# EAGLE schematic ECG_Charge (EAGLE 6.4)
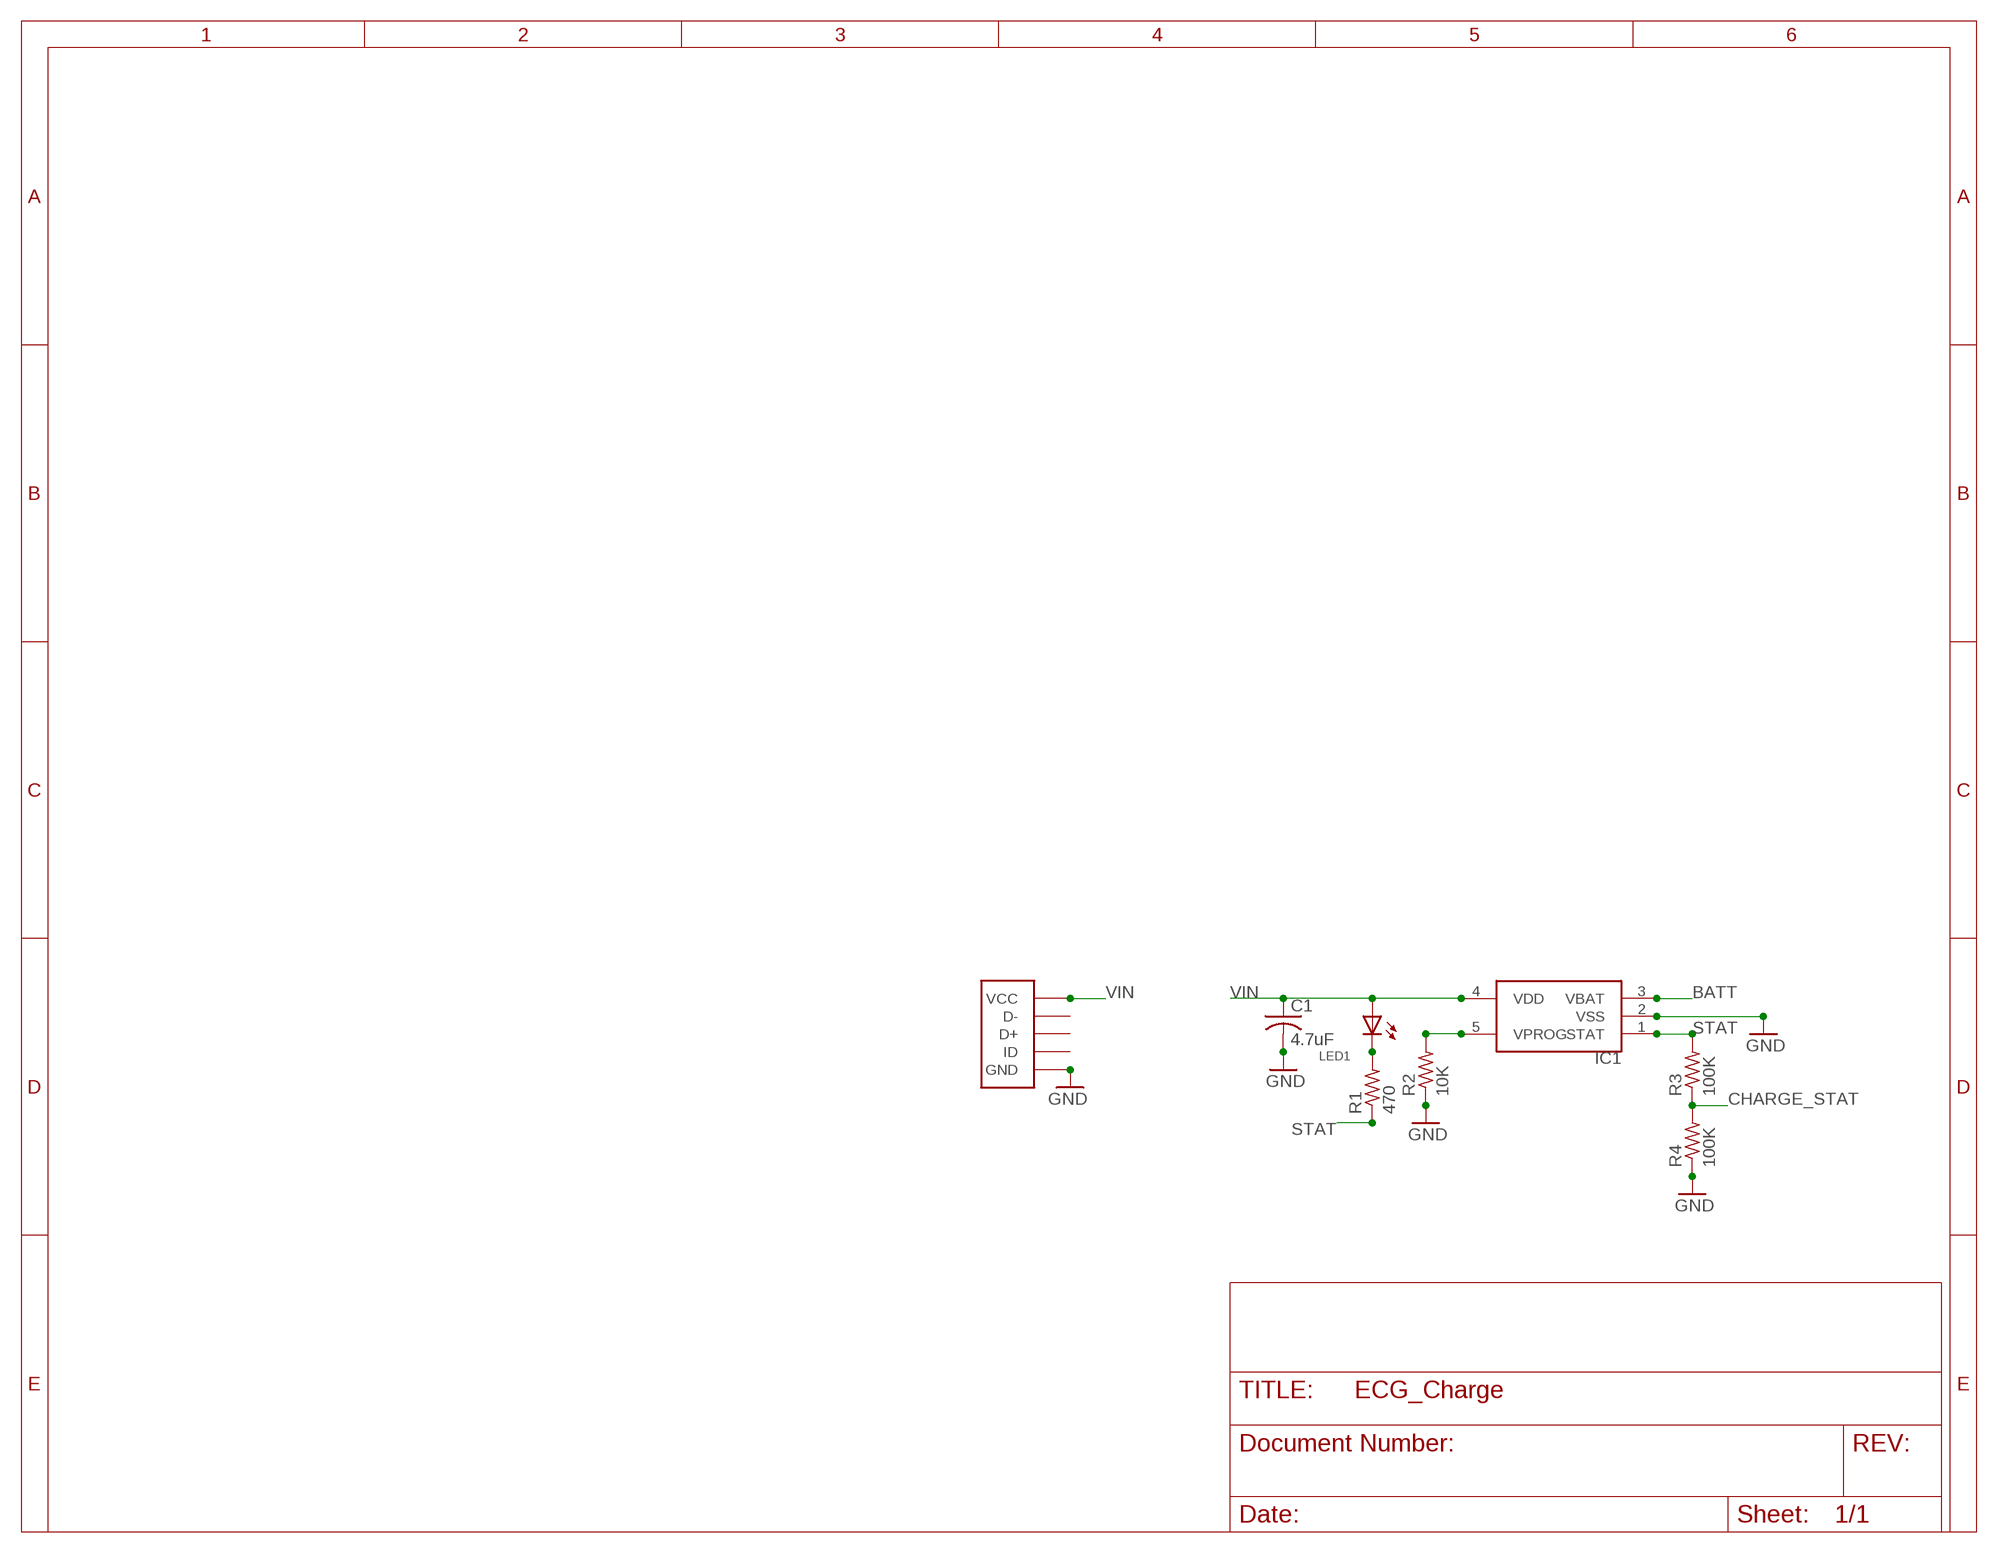
[diagram p0: schematic, sheet 1]

## Parts
C1  4.7uF  C-USC0402  [C0402]
IC1  MCP73832_SOT23-5  [SOT23-5]
J1  USB_MICROC  [USB_MICROB_FEMALE_RA_SMT]
LED1  LED_SMT_0805  [SMT_LED_0805]
R1  470  R-US_R0201  [R0201]
R2  10K  R-US_R0201  [R0201]
R3  100K  R-US_R0201  [R0201]
R4  100K  R-US_R0201  [R0201]

## Nets
BATT: IC1.3(VBAT)
CHARGE_STAT: R3.1 R4.2
GND: C1.2 IC1.2(VSS) J1.P$5(GND) R4.1
N$3: LED1.C R1.2
STAT: IC1.1(STAT) R1.1 R3.2
VIN: C1.1 IC1.4(VDD) J1.P$1(VCC) LED1.A
VPROG: IC1.5(VPROG) R2.2
VSS: R2.1 ; supply symbol labelled GND
Unconnected: J1.P$2(D-) J1.P$3(D+) J1.P$4(ID)

## Library data of the parts
C1 = rcl:C-US: CAPACITOR, American symbol
IC1 = KomodoOpenLab:MCP73832_SOT23-5
J1 = KomodoOpenLab:USB_MICROC; DIGIKEY: WM1399CT-ND; PN: ZX62D-B-5PA8
LED1 = LITEON:LED_SMT_0805
R1-R4 = rcl:R-US_: RESISTOR, American symbol